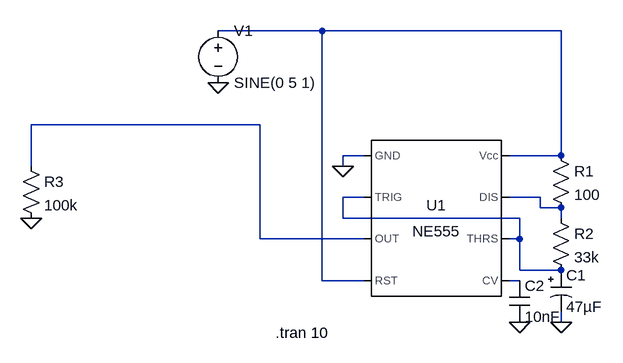
[diagram p0: schematic Draft2.asc]
Draft2.asc, the LTspice schematic file:
Version 4
SHEET 1 880 680
WIRE 16 -96 -144 -96
WIRE 384 -96 16 -96
WIRE -80 48 -432 48
WIRE 80 96 48 96
WIRE 384 96 384 -96
WIRE 384 96 304 96
WIRE -432 112 -432 48
WIRE 48 112 48 96
WIRE 80 160 48 160
WIRE 352 160 304 160
WIRE 352 176 352 160
WIRE 384 176 352 176
WIRE 48 192 48 160
WIRE 320 192 48 192
WIRE 384 192 384 176
WIRE -80 224 -80 48
WIRE 80 224 -80 224
WIRE 320 224 320 192
WIRE 320 224 304 224
WIRE 320 272 320 224
WIRE 384 272 320 272
WIRE 16 288 16 -96
WIRE 80 288 16 288
WIRE 320 288 304 288
WIRE 384 352 384 336
FLAG -144 -16 0
FLAG 48 112 0
FLAG 320 352 0
FLAG 384 352 0
FLAG -432 192 0
SYMBOL Misc\\NE555 192 192 R0
SYMATTR InstName U1
SYMBOL voltage -144 -112 R0
WINDOW 123 0 0 Left 2
WINDOW 39 0 0 Left 2
SYMATTR InstName V1
SYMATTR Value SINE(0 5 1)
SYMBOL res 368 80 R0
SYMATTR InstName R1
SYMATTR Value 100
SYMBOL res 368 176 R0
SYMATTR InstName R2
SYMATTR Value 33k
SYMBOL polcap 368 272 R0
SYMATTR InstName C1
SYMATTR Value 47µF
SYMBOL cap 304 288 R0
SYMATTR InstName C2
SYMATTR Value 10nF
SYMBOL res -448 96 R0
SYMATTR InstName R3
SYMATTR Value 100k
TEXT -56 368 Left 2 !.tran 10

The netlist it stands for:
* Draft2.asc
XU1 0 N003 N002 N001 N005 N003 N004 N001 NE555  ; pins GND TRIG OUT RST CV THRS DIS Vcc
V1 N001 0 SINE(0 5 1)
R1 N001 N004 100
R2 N004 N003 33k
C1 N003 0 47µF
C2 N005 0 10nF
R3 N002 0 100k
.tran 10
.lib NE555.sub
.backanno
.end